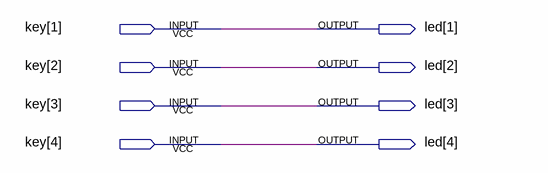
[diagram p0: schematic sheet]
// Quartus schematic RaspinProject.bdf as structural Verilog: 0 symbols, 8 pins
module RaspinProject (
  input  [4:1] key,
  output [4:1] led
);


  assign led = key;
endmodule
